# EAGLE design sproutstrip-6in (EAGLE 5.07)
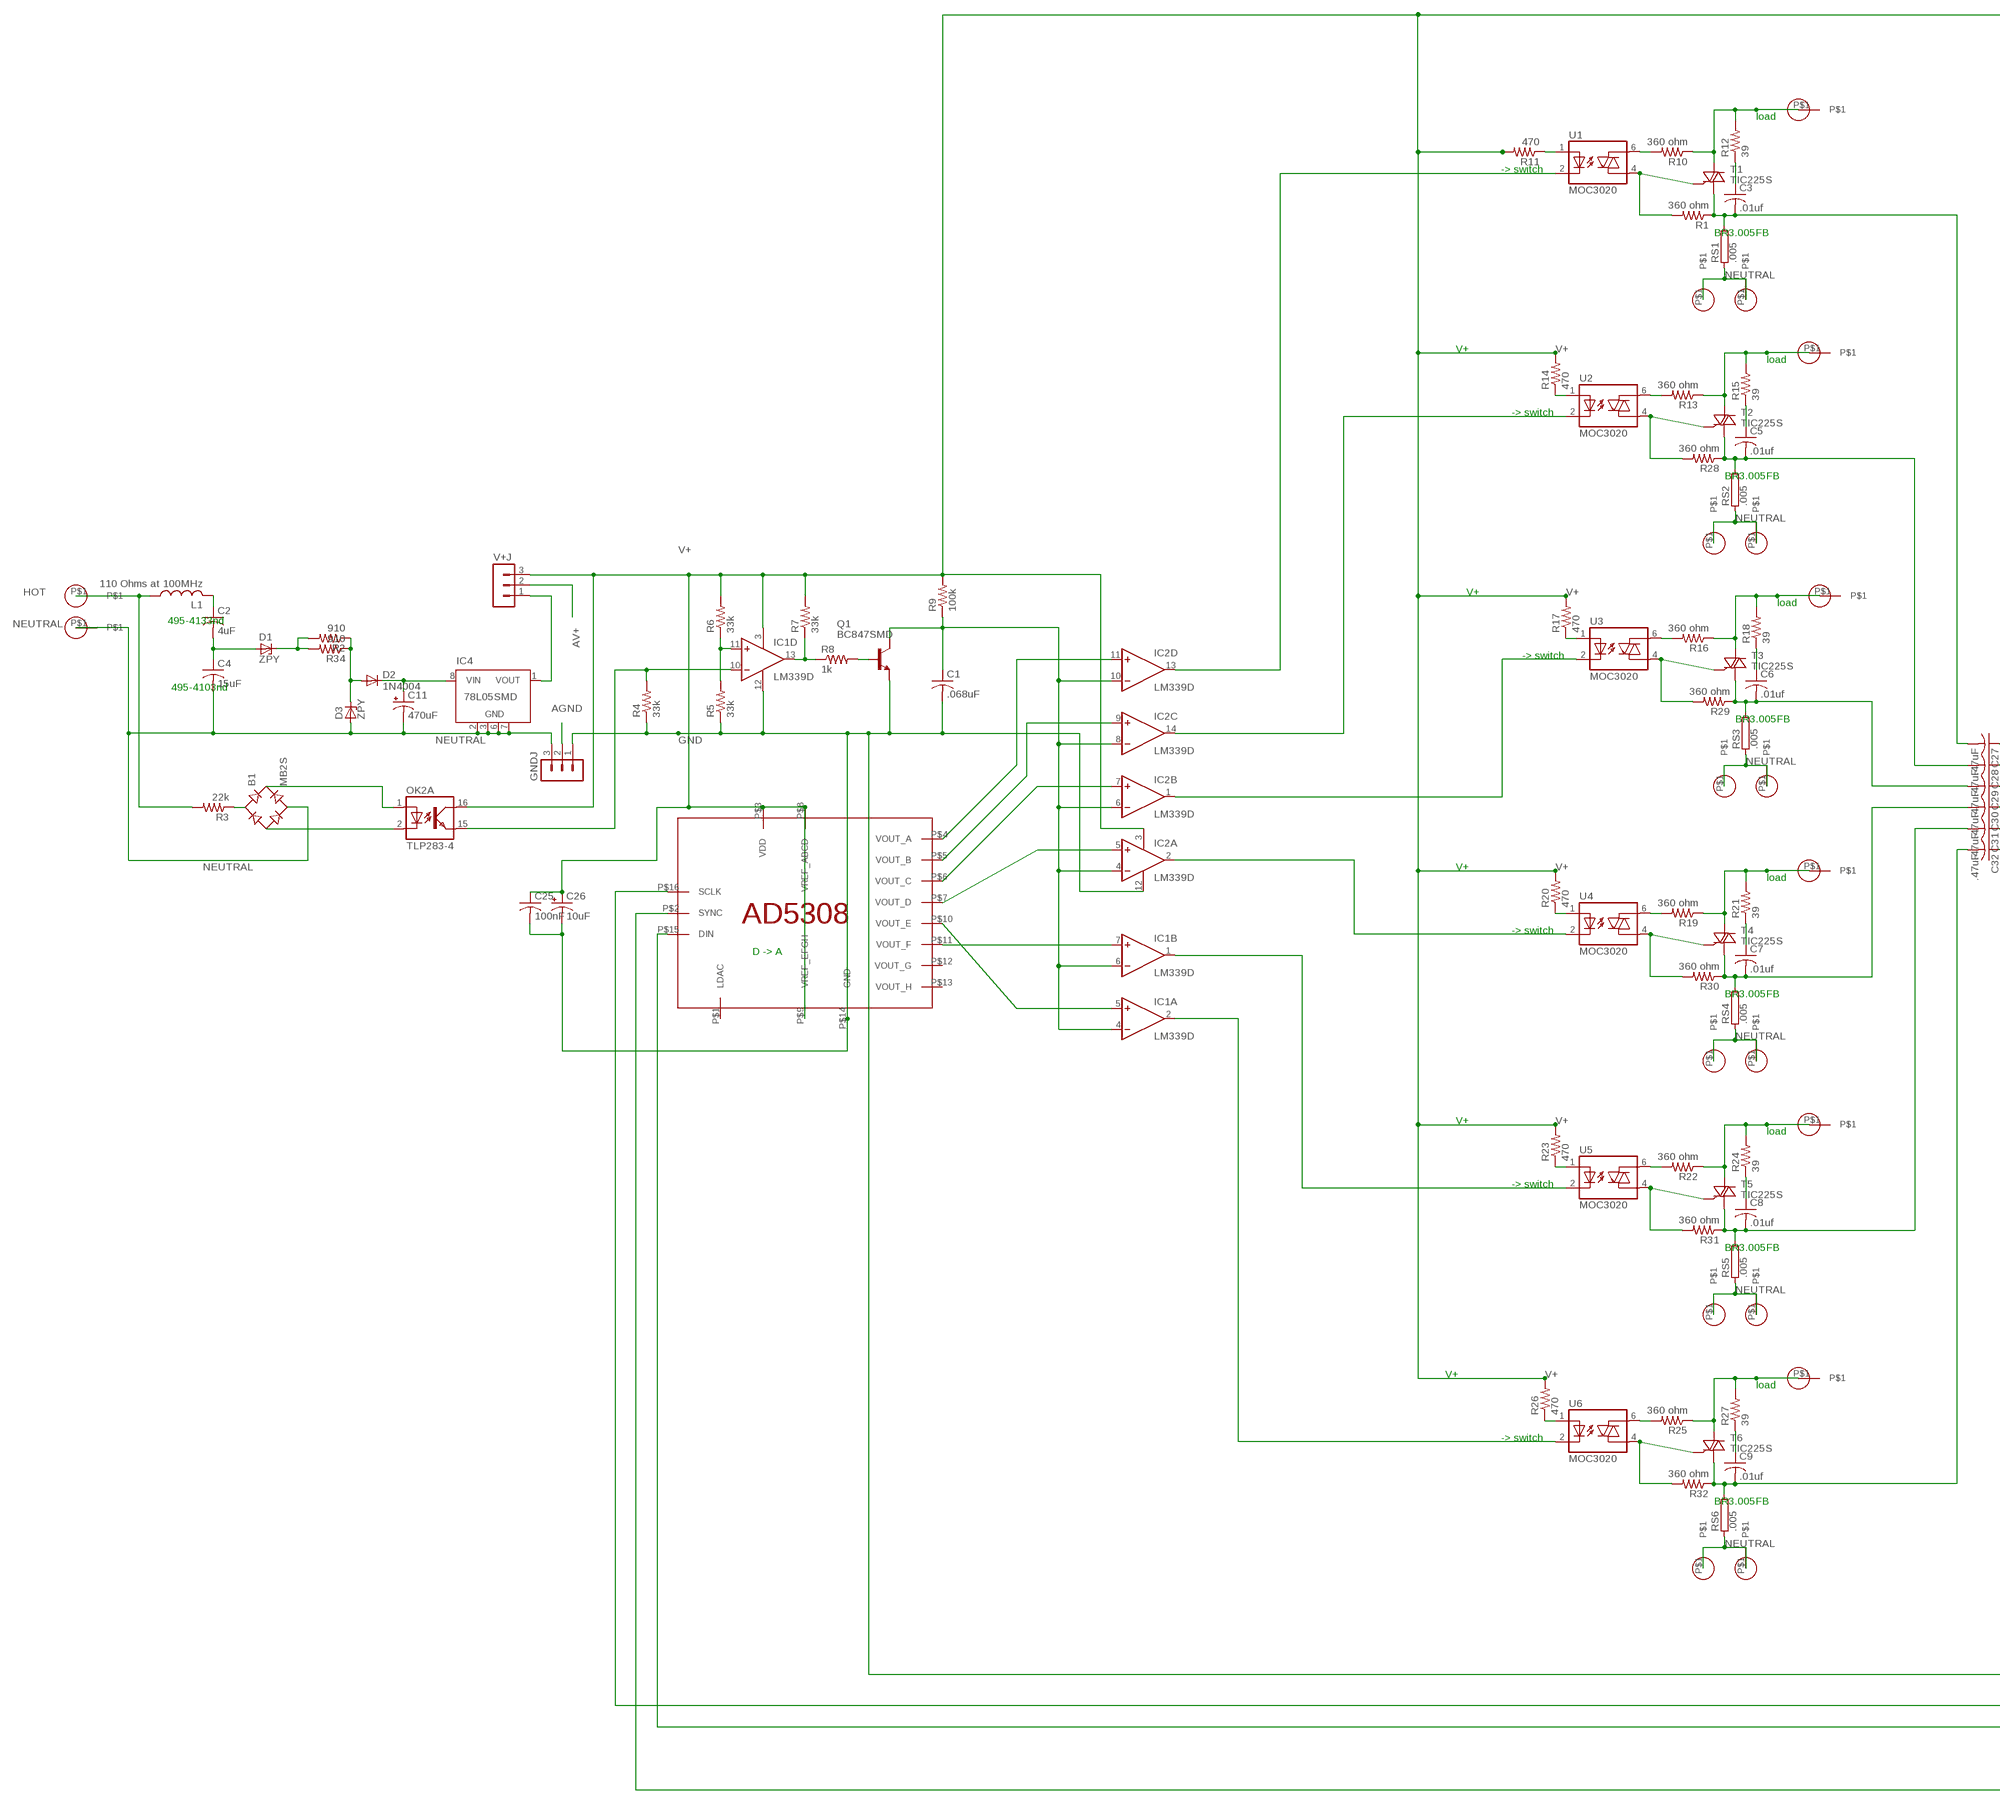
[diagram p0: schematic, sheet 1, part 1 of 2]
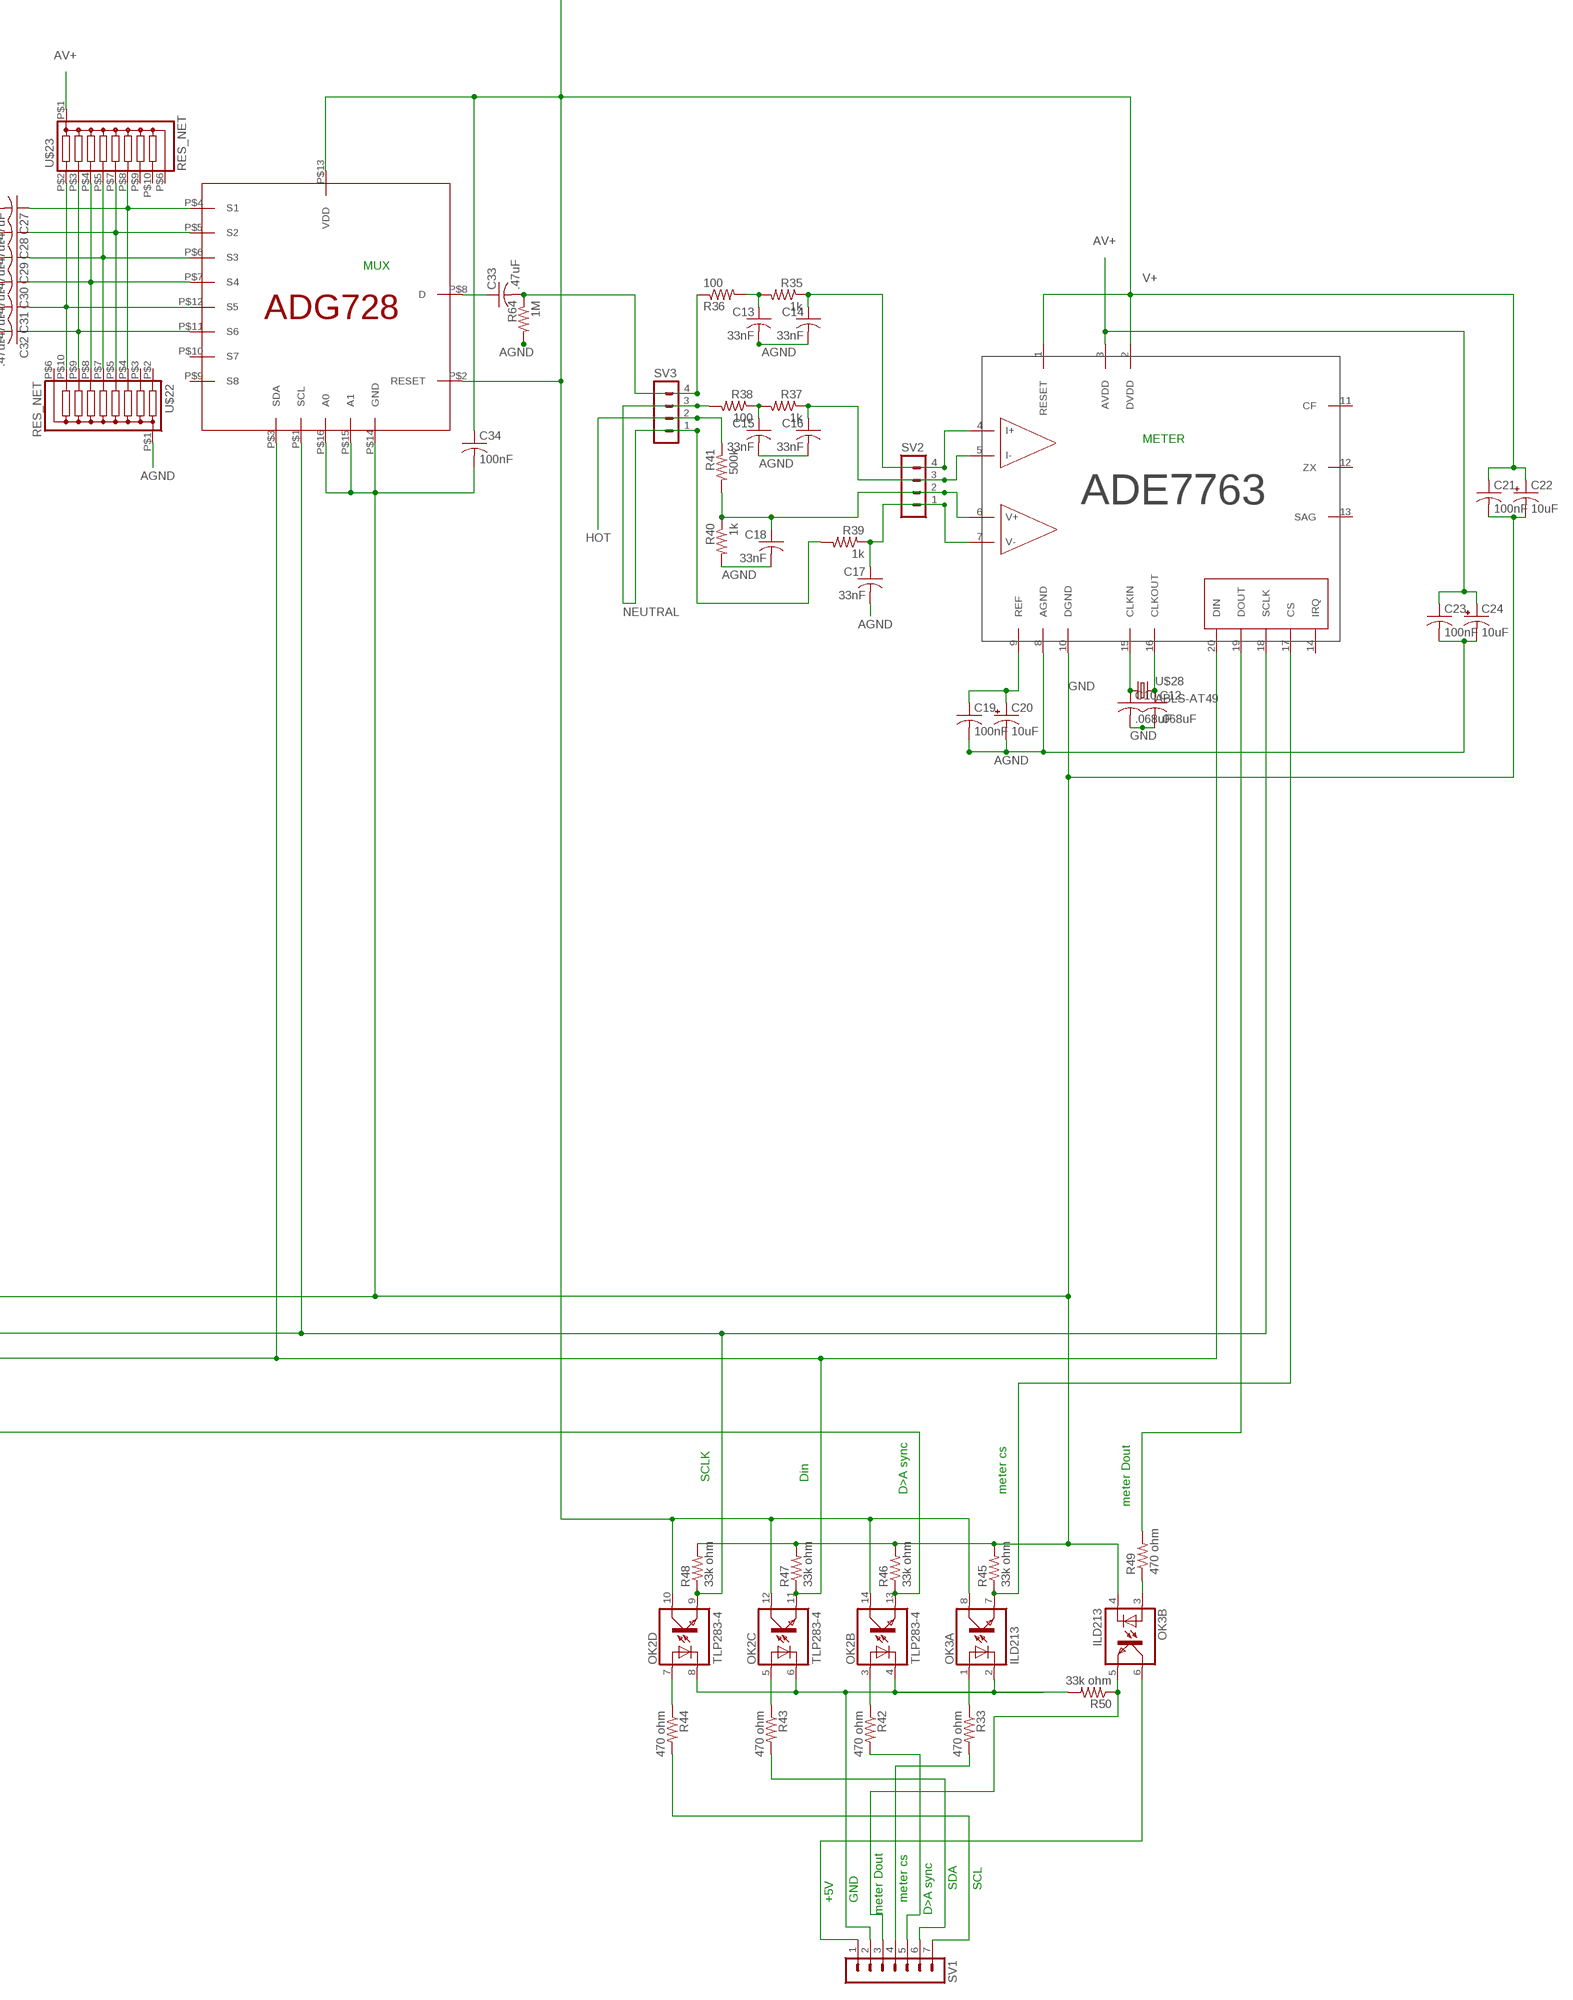
[diagram p1: schematic, sheet 1, part 2 of 2]

## Parts
B1  MB2S  [SOIC-4]
C1  .068uF  C-USC0805  [C0805]
C2  4uF  C-US275-113X316  [C275-113X316]
C3  .01uf  C-USC1206  [C1206]
C4  15uF  C-US275-113X316  [C275-113X316]
C5  .01uf  C-USC1206  [C1206]
C6  .01uf  C-USC1206  [C1206]
C7  .01uf  C-USC1206  [C1206]
C8  .01uf  C-USC1206  [C1206]
C9  .01uf  C-USC1206  [C1206]
C10  .068uF  C-USC0805  [C0805]
C11  470uF  CPOL-USTT5D10  [TT5D10]
C12  .068uF  C-USC0805  [C0805]
C13  33nF  C-USC0805  [C0805]
C14  33nF  C-USC0805  [C0805]
C15  33nF  C-USC0805  [C0805]
C16  33nF  C-USC0805  [C0805]
C17  33nF  C-USC0805  [C0805]
C18  33nF  C-USC0805  [C0805]
C19  100nF  C-USC0805  [C0805]
C20  10uF  CPOL-USA  [PANASONIC_A]
C21  100nF  C-USC0805  [C0805]
C22  10uF  CPOL-USA  [PANASONIC_A]
C23  100nF  C-USC0805  [C0805]
C24  10uF  CPOL-USA  [PANASONIC_A]
C25  100nF  C-USC0805  [C0805]
C26  10uF  CPOL-USA  [PANASONIC_A]
C27  .47uF  C-USC0805  [C0805]
C28  .47uF  C-USC0805  [C0805]
C29  .47uF  C-USC0805  [C0805]
C30  .47uF  C-USC0805  [C0805]
C31  .47uF  C-USC0805  [C0805]
C32  .47uF  C-USC0805  [C0805]
C33  .47uF  C-USC0805  [C0805]
C34  100nF  C-USC0805  [C0805]
D1  ZPY  [DO41Z10]
D2  1N4004  [DO41-10]
D3  ZPY  [DO41Z10]
GNDJ  MA03-1  [MA03-1]
IC1  LM339D  [SO14]
IC2  LM339D  [SO14]
IC4  78L05SMD  [SO08]
L1  110 Ohms at 100MHz  L-US0207/5V  [0207/5V]
OK2  TLP283-4  [MINI-FLAT-16]
OK3  ILD213  [SOIC08]
Q1  BC847SMD  [SOT23]
R1  360 ohm  R-US_R0805  [R0805]
R2  910  R-US_0309/V  [0309V]
R3  22k  R-US_R0805  [R0805]
R4  33k  R-US_R0805  [R0805]
R5  33k  R-US_R0805  [R0805]
R6  33k  R-US_R0805  [R0805]
R7  33k  R-US_R0805  [R0805]
R8  1k  R-US_R0805  [R0805]
R9  100k  R-US_R0805  [R0805]
R10  360 ohm  R-US_R0805  [R0805]
R11  470  R-US_R0805  [R0805]
R12  39  R-US_M1206  [M1206]
R13  360 ohm  R-US_R0805  [R0805]
R14  470  R-US_R0805  [R0805]
R15  39  R-US_M1206  [M1206]
R16  360 ohm  R-US_R0805  [R0805]
R17  470  R-US_R0805  [R0805]
R18  39  R-US_M1206  [M1206]
R19  360 ohm  R-US_R0805  [R0805]
R20  470  R-US_R0805  [R0805]
R21  39  R-US_M1206  [M1206]
R22  360 ohm  R-US_R0805  [R0805]
R23  470  R-US_R0805  [R0805]
R24  39  R-US_M1206  [M1206]
R25  360 ohm  R-US_R0805  [R0805]
R26  470  R-US_R0805  [R0805]
R27  39  R-US_M1206  [M1206]
R28  360 ohm  R-US_R0805  [R0805]
R29  360 ohm  R-US_R0805  [R0805]
R30  360 ohm  R-US_R0805  [R0805]
R31  360 ohm  R-US_R0805  [R0805]
R32  360 ohm  R-US_R0805  [R0805]
R33  470 ohm  R-US_R0805  [R0805]
R34  910  R-US_0309/V  [0309V]
R35  1k  R-US_R0805  [R0805]
R36  100  R-US_R0805  [R0805]
R37  1k  R-US_R0805  [R0805]
R38  100  R-US_R0805  [R0805]
R39  1k  R-US_R0805  [R0805]
R40  1k  R-US_R0805  [R0805]
R41  500k  R-US_R0805  [R0805]
R42  470 ohm  R-US_R0805  [R0805]
R43  470 ohm  R-US_R0805  [R0805]
R44  470 ohm  R-US_R0805  [R0805]
R45  33k ohm  R-US_R0805  [R0805]
R46  33k ohm  R-US_R0805  [R0805]
R47  33k ohm  R-US_R0805  [R0805]
R48  33k ohm  R-US_R0805  [R0805]
R49  470 ohm  R-US_R0805  [R0805]
R50  33k ohm  R-US_R0805  [R0805]
R64  1M  R-US_R0805  [R0805]
RS1  .005  RKP292  [KP292]
RS2  .005  RKP292  [KP292]
RS3  .005  RKP292  [KP292]
RS4  .005  RKP292  [KP292]
RS5  .005  RKP292  [KP292]
RS6  .005  RKP292  [KP292]
SV1  MA07-1  [MA07-1]
SV2  MA04-1  [MA04-1]
SV3  MA04-1  [MA04-1]
T1  TIC225S  [TO220DS]
T2  TIC225S  [TO220DS]
T3  TIC225S  [TO220DS]
T4  TIC225S  [TO220DS]
T5  TIC225S  [TO220DS]
T6  TIC225S  [TO220DS]
U1  MOC3020  [DIL06C]
U2  MOC3020  [DIL06C]
U3  MOC3020  [DIL06C]
U4  MOC3020  [DIL06C]
U5  MOC3020  [DIL06C]
U6  MOC3020  [DIL06C]
U$1  AD5308  [TSSOP16A]
U$2  WIRE_HOLE  [WIRE_HOLE]
U$3  WIRE_HOLE  [WIRE_HOLE]
U$4  WIRE_HOLE  [WIRE_HOLE]
U$5  WIRE_HOLE  [WIRE_HOLE]
U$6  WIRE_HOLE  [WIRE_HOLE]
U$7  WIRE_HOLE  [WIRE_HOLE]
U$8  WIRE_HOLE  [WIRE_HOLE]
U$9  WIRE_HOLE  [WIRE_HOLE]
U$10  WIRE_HOLE  [WIRE_HOLE]
U$11  WIRE_HOLE  [WIRE_HOLE]
U$12  WIRE_HOLE  [WIRE_HOLE]
U$13  WIRE_HOLE  [WIRE_HOLE]
U$14  WIRE_HOLE  [WIRE_HOLE]
U$15  WIRE_HOLE  [WIRE_HOLE]
U$16  WIRE_HOLE  [WIRE_HOLE]
U$17  WIRE_HOLE  [WIRE_HOLE]
U$18  WIRE_HOLE  [WIRE_HOLE]
U$19  WIRE_HOLE  [WIRE_HOLE]
U$20  WIRE_HOLE  [WIRE_HOLE]
U$21  WIRE_HOLE  [WIRE_HOLE]
U$22  RES_NET  [RES_NET]
U$23  RES_NET  [RES_NET]
U$26  ADE7763  [SSOP20DB]
U$27  ADG728  [TSSOP16B]
U$28  ABLS-AT49  [ABLS]
V+J  MA03-1  [MA03-1]

## Nets
AGND: C13.2 C14.2 C15.2 C16.2 C17.2 C18.2 C19.2 C20.- C23.2 C24.- GNDJ.2 R40.2 R64.2 U$22.P$1(C1) U$26.8(AGND)
AV+: C23.1 C24.+ U$23.P$1(C1) U$26.3(AVDD) V+J.2
EXT_+5V: OK3.6(B:COL) SV1.1
EXT_GND: OK2.4(B:C) OK2.6(C:C) OK2.8(D:C) OK3.2(A:C) R50.2 SV1.2
GND: C1.2 C10.2 C12.2 C21.2 C22.- C25.2 C26.- C34.2 GNDJ.1 IC1.12(P:GND) IC2.12(P:GND) OK3.4(B:C) Q1.2(E) R4.1 R5.1 R45.2 R46.2 R47.2 R48.2 U$1.P$14(GND) U$26.10(DGND) U$27.P$14(GND) U$27.P$15(A1) U$27.P$16(A0)
HOT: L1.1 R3.2 R41.1 SV3.2 U$21.P$1
I$1: IC2.13(D:OUT) U1.2(C)
I$2: IC2.14(C:OUT) U2.2(C)
I$3: IC2.1(B:OUT) U3.2(C)
I$4: IC2.2(A:OUT) U4.2(C)
I$6: IC1.2(A:OUT) U6.2(C)
L$1: R10.1 R12.2 T1.A2 U$2.P$1
L$2: R13.1 R15.2 T2.A2 U$5.P$1
L$3: R16.1 R18.2 T3.A2 U$8.P$1
L$4: R19.1 R21.2 T4.A2 U$11.P$1
L$5: R22.1 R24.2 T5.A2 U$14.P$1
L$6: R25.1 R27.2 T6.A2 U$17.P$1
N$2: D1.C R2.2 R34.2
N$3: IC1.10(D:-IN) OK2.15(A:EMIT) R4.2
N$5: R11.1 U1.1(A)
N$6: IC1.11(D:+IN) R5.2 R6.1
N$7: IC1.13(D:OUT) R7.1 R8.1
N$8: IC2.9(C:+IN) U$1.P$5(VOUT_B)
N$9: Q1.1(B) R8.2
N$10: IC2.7(B:+IN) U$1.P$6(VOUT_C)
N$11: IC2.5(A:+IN) U$1.P$7(VOUT_D)
N$12: IC1.5(A:+IN) U$1.P$10(VOUT_E)
N$13: IC2.11(D:+IN) U$1.P$4(VOUT_A)
N$14: IC1.7(B:+IN) U$1.P$11(VOUT_F)
N$15: R1.2 T1.G U1.4(A1)
N$16: R10.2 U1.6(A2)
N$17: C33.1 U$27.P$8(D)
N$18: R14.1 U2.1(A)
N$19: R16.2 U3.6(A2)
N$20: C5.1 R15.1
N$21: R13.2 U2.6(A2)
N$22: C31.1 U$22.P$10 U$23.P$2 U$27.P$12(S5)
N$23: R17.1 U3.1(A)
N$24: C6.2 C29.2 R29.1 RS3.2 T3.A1
N$25: C6.1 R18.1
N$26: C19.1 C20.+ U$26.9(REF)
N$27: C2.2 C4.1 D1.A
N$28: B1.~1(AC1) R3.1
N$29: B1.+ OK2.1(A:A)
N$30: B1.- OK2.2(A:C)
N$31: C2.1 L1.2
N$32: D2.A D3.C R2.1 R34.1
N$33: R20.1 U4.1(A)
N$34: C7.1 R21.1
N$35: C3.1 R12.1
N$36: R19.2 U4.6(A2)
N$37: OK3.1(A:A) R33.1
N$38: R23.1 U5.1(A)
N$39: C8.1 R24.1
N$40: R22.2 U5.6(A2)
N$41: R26.1 U6.1(A)
N$42: R28.2 T2.G U2.4(A1)
N$43: C9.1 R27.1
N$44: R25.2 U6.6(A2)
N$45: R29.2 T3.G U3.4(A1)
N$46: R30.2 T4.G U4.4(A1)
N$47: R31.2 T5.G U5.4(A1)
N$48: R32.2 T6.G U6.4(A1)
N$49: C32.1 U$22.P$9 U$23.P$3 U$27.P$11(S6)
N$50: OK2.3(B:A) R42.1
N$51: IC1.1(B:OUT) U5.2(C)
N$52: OK2.5(C:A) R43.1
N$53: OK2.7(D:A) R44.1
N$55: OK3.7(A:EMIT) R45.1 U$26.17(CS)
N$57: R44.2 SV1.7
N$58: C11.+ D2.C IC4.8(VIN)
N$59: R43.2 SV1.6
N$60: R42.2 SV1.5
N$63: OK3.3(B:A) R49.1
N$64: C9.2 C32.2 R32.1 RS6.2 T6.A1
N$66: OK3.5(B:EMIT) R50.1 SV1.3
N$67: C10.1 U$26.15(CLKIN) U$28.P$1
N$68: C12.1 U$26.16(CLKOUT) U$28.P$2
N$69: C16.1 R37.1 SV2.3 U$26.5(I-)
N$70: C18.1 R40.1 R41.2 SV2.2 U$26.6(V+)
N$71: R49.2 U$26.19(DOUT)
N$72: C17.1 R39.1 SV2.1 U$26.7(V-)
N$73: R33.2 SV1.4
N$74: C8.2 C31.2 R31.1 RS5.2 T5.A1
N$75: C13.1 R35.2 R36.2
N$76: OK2.13(B:EMIT) R46.1 U$1.P$2(SYNC)
N$78: C15.1 R37.2 R38.1
N$79: IC4.1(VOUT) V+J.1
N$80: C7.2 C30.2 R30.1 RS4.2 T4.A1
N$83: C30.1 U$22.P$8 U$23.P$4 U$27.P$7(S4)
N$84: C29.1 U$22.P$7 U$23.P$5 U$27.P$6(S3)
N$85: C28.1 U$22.P$5 U$23.P$7 U$27.P$5(S2)
N$86: C27.1 U$22.P$4 U$23.P$8 U$27.P$4(S1)
N$87: C5.2 C28.2 R28.1 RS2.2 T2.A1
N$88: C3.2 C27.2 R1.1 RS1.2 T1.A1
N$89: C33.2 R36.1 R64.1 SV3.4
NEUTRAL: B1.~2(AC2) C4.2 C11.- D3.A GNDJ.3 IC4.2(GND) IC4.3(GND) IC4.6(GND) IC4.7(GND) R38.2 R39.2 RS1.1 RS2.1 RS3.1 RS4.1 RS5.1 RS6.1 SV3.1 SV3.3 U$3.P$1 U$4.P$1 U$6.P$1 U$7.P$1 U$9.P$1 U$10.P$1 U$12.P$1 U$13.P$1 U$15.P$1 U$16.P$1 U$18.P$1 U$19.P$1 U$20.P$1
O$2: C14.1 R35.1 SV2.4 U$26.4(I+)
SAW: C1.1 IC1.4(A:-IN) IC1.6(B:-IN) IC2.4(A:-IN) IC2.6(B:-IN) IC2.8(C:-IN) IC2.10(D:-IN) Q1.3(C) R9.1
SCL: OK2.9(D:EMIT) R48.1 U$1.P$16(SCLK) U$26.18(SCLK) U$27.P$1(SCL)
SDA: OK2.11(C:EMIT) R47.1 U$1.P$15(DIN) U$26.20(DIN) U$27.P$3(SDA)
V+: C21.1 C22.+ C25.1 C26.+ C34.1 IC1.3(P:V+) IC2.3(P:V+) OK2.10(D:COL) OK2.12(C:COL) OK2.14(B:COL) OK2.16(A:COL) OK3.8(A:COL) R6.2 R7.2 R9.2 R11.2 R14.2 R17.2 R20.2 R23.2 R26.2 U$1.P$3(VDD) U$1.P$8(VREF_ABCD) U$1.P$9(VREF_EFGH) U$26.1(RESET) U$26.2(DVDD) U$27.P$2(RESET) U$27.P$13(VDD) V+J.3
Unconnected: IC1.8(C:-IN) IC1.9(C:+IN) IC1.14(C:OUT) IC4.4(NC) IC4.5(NC) U$1.P$1(LDAC) U$1.P$12(VOUT_G) U$1.P$13(VOUT_H) U$22.P$2 U$22.P$3 U$22.P$6(C2) U$23.P$6(C2) U$23.P$9 U$23.P$10 U$26.11(CF) U$26.12(ZX) U$26.13(SAG) U$26.14(IRQ) U$27.P$9(S8) U$27.P$10(S7)

## Notes on the sheet
- load
- -> switch
- BR3.005FB
- V+
- load
- -> switch
- BR3.005FB
- V+
- load
- 495-4133nd
- -> switch
- 495-4103nd
- BR3.005FB
- MUX
- V+
- load
- -> switch
- METER
- D -> A
- BR3.005FB
- V+
- load
- -> switch
- BR3.005FB
- V+
- load
- -> switch
- BR3.005FB
- SCLK | Din
- D>A sync | meter cs
- meter Dout
- SDA | SCL
- +5V | GND | meter cs
- meter Dout | D>A sync

## Library data of the parts
B1 = rectifier:MB*S: Bridge Rectifier Source: http://www.fairchildsemi.com/ds/MB/MB6S.pdf
C1-C10 C12-C19 C21 C23 C25 C27-C34 = rcl:C-US: CAPACITOR, American symbol
C11 C20 C22 C24 C26 = rcl:CPOL-US: POLARIZED CAPACITOR, American symbol
D1 D3 = diode:ZPY: Z DIODE 1 W
D2 = diode:1N4004: DIODE general purpose rectifier, 1 A
GNDJ V+J = con-lstb:MA03-1: PIN HEADER
IC1 IC2 = linear:LM339: Low Power Low Offset Voltage Quad Comparators with open collector; LM139/LM239/LM339/LM2901/LM3302
IC4 = linear:78L*SMD: Positive VOLTAGE REGULATOR
L1 = rcl:L-US: INDUCTOR, American symbol
OK2 = optocoupler-2:TLP283-4: TOSHIBA PHOTOCOUPLER GaAs IRED & PHOTO-TRANSISTOR Source: http://www.semicon.toshiba.co.jp/td/en/Opto/Photocoupler/en_20050928_TLP283_datasheet.pdf
OK3 = optocoupler:ILD2*: Siemens ILD205/206/207/211/213/217 DUAL PHOTOTRANSISTOR SMALL OUTLINE SURFACE MOUNT OPTOCOUPLER Source: 153385-da-01-en-Optocoupler_ILD205-T.pdf
Q1 = transistor-npn:BC847*: NPN Transistor
R1-R50 R64 = rcl:R-US_: RESISTOR, American symbol
RS1-RS6 = resistor-power:R: Power Resitor
SV1 = con-lstb:MA07-1: PIN HEADER
SV2 SV3 = con-lstb:MA04-1: PIN HEADER
T1-T6 = triac:TIC225S: TRIAC
U1-U6 = optocoupler:MOC3020
U$1 = strip:AD5308
U$2-U$21 = strip:WIRE_HOLE
U$22 U$23 = strip:RES_NET
U$26 = strip:ADE7763
U$27 = strip:ADG728
U$28 = crystal:ABLS-AT49

## Board
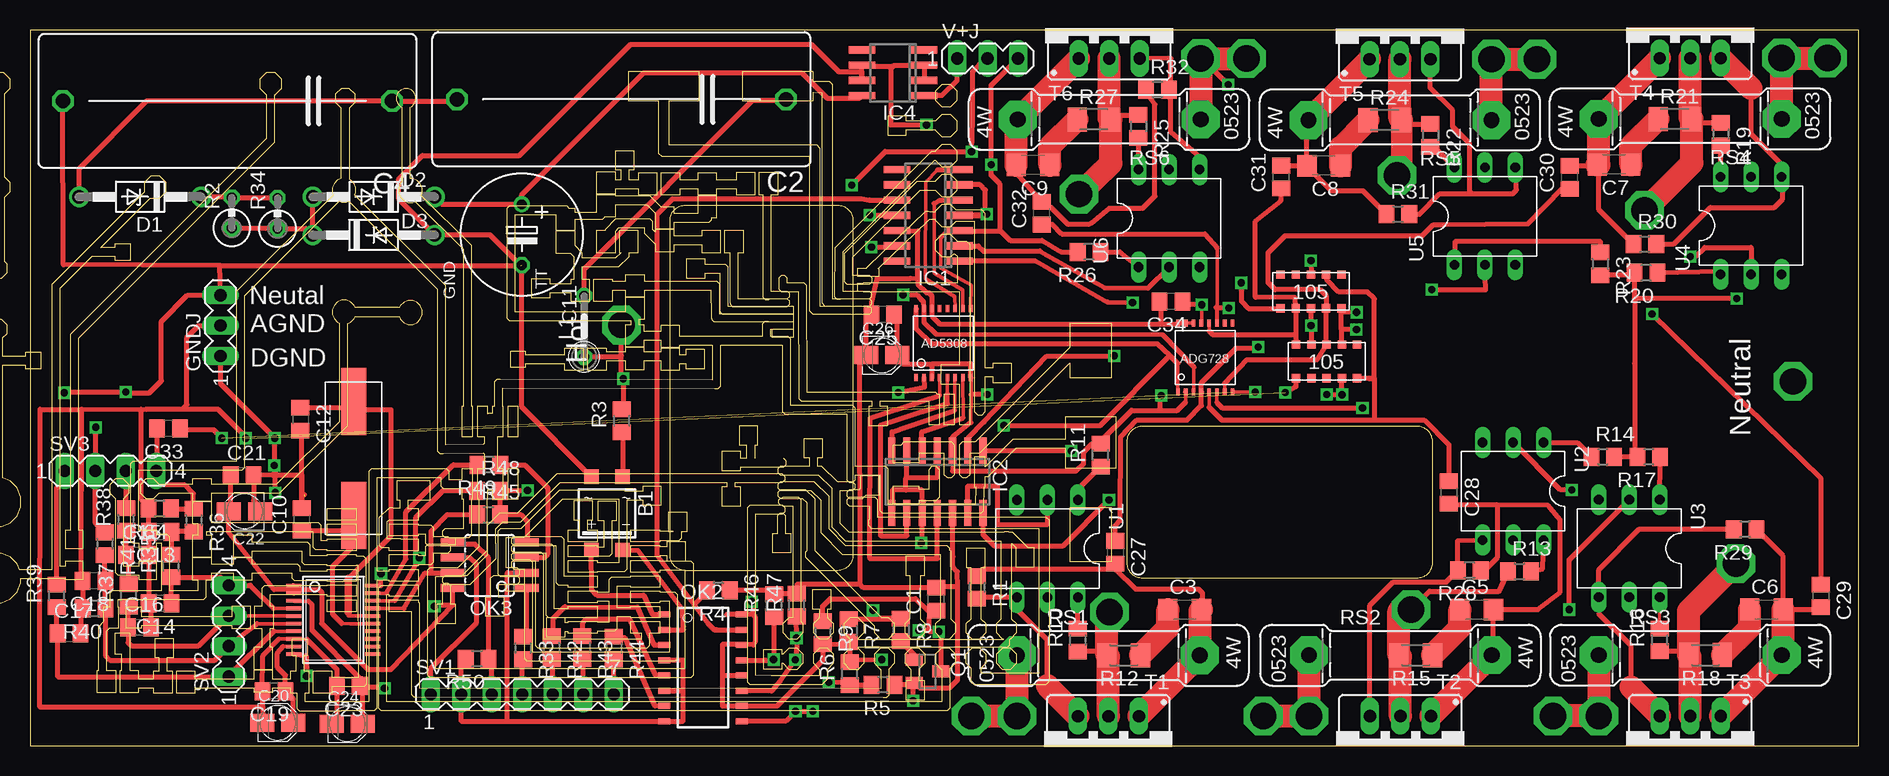
[diagram p2: board, top side]
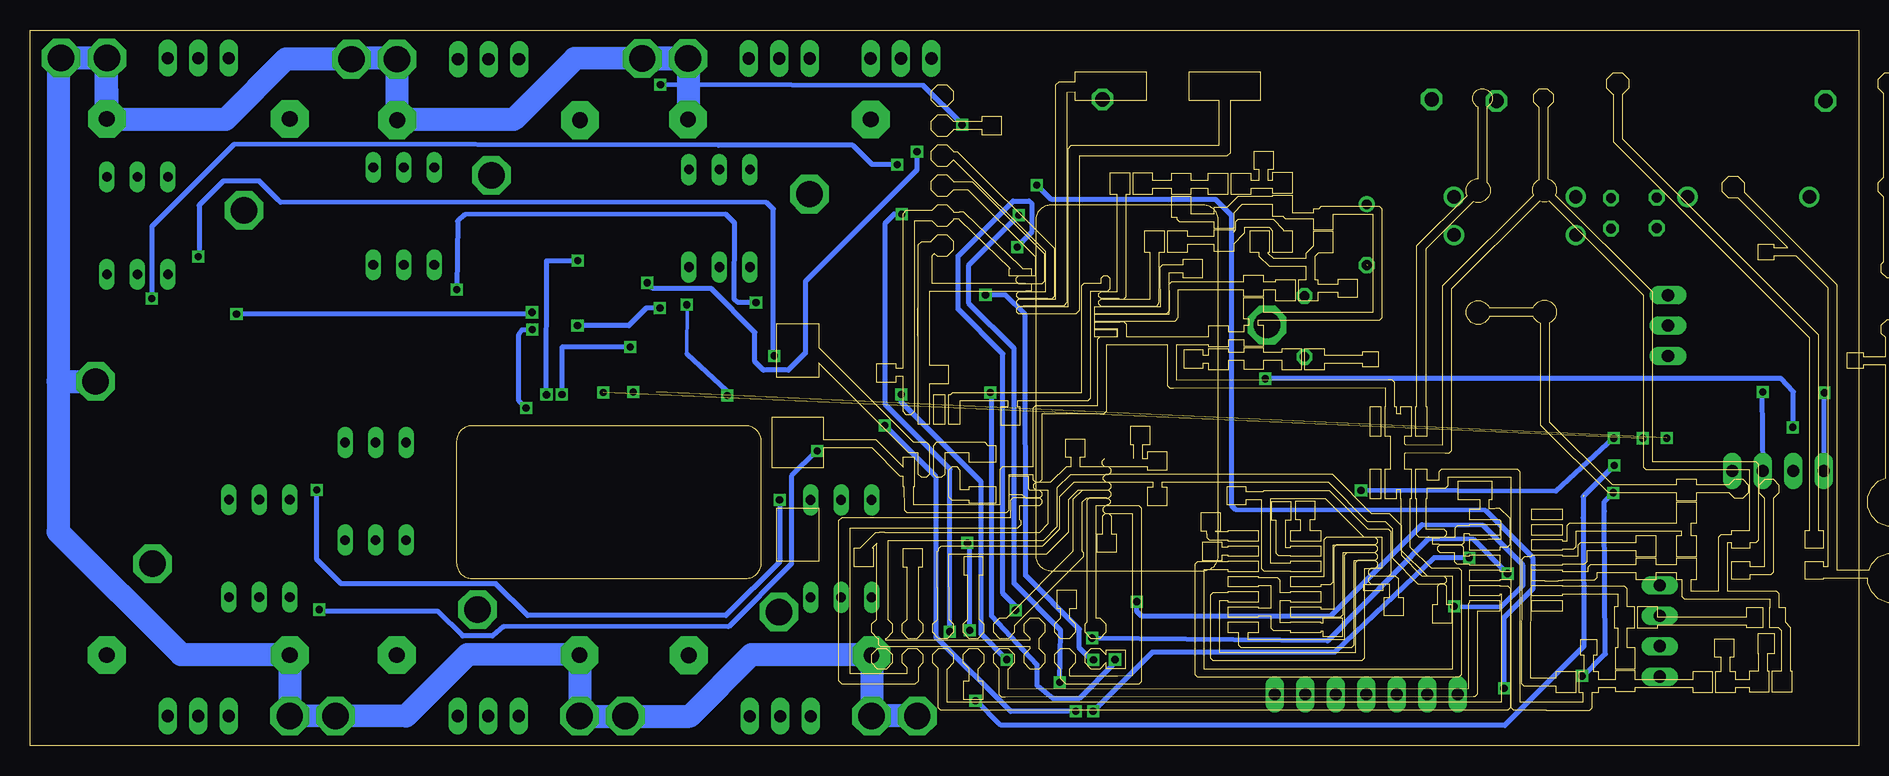
[diagram p3: board, bottom side, seen from below]

Size 152.38 x 59.69 mm. Coordinates in mm from the lower left corner, seen from the top.
Outline: 0,0 152.38,0 152.38,59.69 0,59.69 0,0
Outline: 115.57,26.67 arc-90 116.84,25.4 116.84,15.24 arc-90 115.57,13.97 92.71,13.97 arc-90 91.44,15.24 91.44,25.4 arc-90 92.71,26.67 115.57,26.67
Outline: 67.31,45.09 arc-90 68.58,43.81 68.58,15.88 arc-90 67.31,14.61 54.61,14.61 arc-90 53.34,15.88 53.34,43.81 arc-90 54.61,45.09 67.31,45.09
Copper layers (1*16): Top 0.035mm / dielectric 1.5mm / Bottom 0.035mm
Design rules "default *": minimum track width 10mil, minimum drill 24mil, track to track 0.21mm, track to pad 0.21mm, pad to pad 0.21mm, via to via 0.21mm, smd to smd 0.21mm, copper to edge 40mil, drill to drill 8mil, minimum pad ring 10mil, minimum via ring 8mil, stop-mask expansion 4mil, vias tented up to drill 0mil, thermal gap 10mil
Milling: 2023 lines

### Footprints (pad centres in the part's own frame; a part is rotated, then mirrored left to right if it is on the bottom)
SOIC-4 = smd 1.2 x 1.2: + 1.3,3.05; - -1.3,3.05; ~1 -1.3,-3.05; ~2 1.3,-3.05
C0805 = smd 1.3 x 1.5: 1 -0.95,0; 2 0.95,0
C275-113X316 = drill 1.194 octagon: 1 -13.716,0; 2 13.716,0
C1206 = smd 1.6 x 1.8: 1 -1.4,0; 2 1.4,0
TT5D10 = drill 0.813 round: + -2.54,0 | drill 0.813 octagon: - 2.54,0
PANASONIC_A = smd 2 x 1.5: + 1.3,0; - -1.3,0
DO41Z10 = drill 1.118 round: A 5.08,0; C -5.08,0
DO41-10 = drill 1.118 round: A 5.08,0; C -5.08,0
MA03-1 = drill 1.016 long: 1 -2.54,0; 2 0,0; 3 2.54,0
SO14 = smd 0.6 x 2.2: 1 -3.81,-2.6; 2 -2.54,-2.6; 3 -1.27,-2.6; 4 0,-2.6; 5 1.27,-2.6; 6 2.54,-2.6; 7 3.81,-2.6; 8 3.81,2.6; 9 2.54,2.6; 10 1.27,2.6; 11 0,2.6; 12 -1.27,2.6; 13 -2.54,2.6; 14 -3.81,2.6
SO08 = smd 0.6 x 2.2: 1 -1.905,-2.6; 2 -0.635,-2.6; 3 0.635,-2.6; 4 1.905,-2.6; 5 1.905,2.6; 6 0.635,2.6; 7 -0.635,2.6; 8 -1.905,2.6
0207/5V = drill 0.813 octagon: 1 -2.54,0; 2 2.54,0
MINI-FLAT-16 = smd 1 x 0.5: 1 -3.24,4.445; 2 -3.24,3.175; 3 -3.24,1.905; 4 -3.24,0.635; 5 -3.24,-0.635; 6 -3.24,-1.905; 7 -3.24,-3.175; 8 -3.24,-4.445; 9 3.24,-4.445; 10 3.24,-3.175; 11 3.24,-1.905; 12 3.24,-0.635; 13 3.24,0.635; 14 3.24,1.905; 15 3.24,3.175; 16 3.24,4.445
SOIC08 = smd 0.66 x 2.032: 1 -1.905,-3.073; 2 -0.635,-3.073; 3 0.635,-3.073; 4 1.905,-3.073; 5 1.905,3.073; 6 0.635,3.073; 7 -0.635,3.073; 8 -1.905,3.073
SOT23 = smd 1 x 1.4: 1 -0.95,-1.1; 2 0.95,-1.1; 3 0,1.1
R0805 = smd 1.3 x 1.5: 1 -0.95,0; 2 0.95,0
0309V = drill 0.813 octagon: 1 -1.27,0; 2 1.27,0
M1206 = smd 1.6 x 2: 1 -1.4,0; 2 1.4,0
KP292 = drill 1.321 pad 3.15 octagon: 1 -7.62,0; 2 7.62,0
MA07-1 = drill 1.016 long: 1 -7.62,0; 2 -5.08,0; 3 -2.54,0; 4 0,0; 5 2.54,0; 6 5.08,0; 7 7.62,0
MA04-1 = drill 1.016 long: 1 -3.81,0; 2 -1.27,0; 3 1.27,0; 4 3.81,0
TO220DS = drill 1.016 long: A1 -2.54,-2.54; A2 0,-2.54; G 2.54,-2.54
DIL06C = drill 0.8 long: 1 -2.54,-4.064; 2 0,-4.064; 3 2.54,-4.064; 4 2.54,4.064; 5 0,4.064; 6 -2.54,4.064
TSSOP16A = smd 0.305 x 0.61: P$1 -2.479,-2.872; P$2 -1.829,-2.872; P$3 -1.179,-2.872; P$4 -0.529,-2.872; P$5 0.121,-2.872; P$6 0.771,-2.872; P$7 1.421,-2.872; P$8 2.071,-2.872; P$9 2.071,2.878; P$10 1.421,2.878; P$11 0.771,2.878; P$12 0.121,2.878; P$13 -0.529,2.878; P$14 -1.179,2.878; P$15 -1.829,2.878; P$16 -2.479,2.878
WIRE_HOLE = drill 2.2 octagon: P$1 0,0
RES_NET = smd 0.7 x 0.7: P$1 -1.4,2.54; P$2 -1.4,1.27; P$3 -1.4,0; P$4 -1.4,-1.27; P$5 -1.4,-2.54; P$6 1.4,-2.54; P$7 1.4,-1.27; P$8 1.4,0; P$9 1.4,1.27; P$10 1.4,2.54
SSOP20DB = smd 0.305 x 1.245: 1 -2.857,-3.302; 2 -2.222,-3.302; 3 -1.587,-3.302; 4 -0.952,-3.302; 5 -0.317,-3.302; 6 0.318,-3.302; 7 0.953,-3.302; 8 1.588,-3.302; 9 2.223,-3.302; 10 2.858,-3.302; 11 2.858,3.302; 12 2.223,3.302; 13 1.588,3.302; 14 0.953,3.302; 15 0.318,3.302; 16 -0.317,3.302; 17 -0.952,3.302; 18 -1.587,3.302; 19 -2.222,3.302; 20 -2.857,3.302
TSSOP16B = smd 0.305 x 0.61: P$1 -2.483,-2.759; P$2 -1.833,-2.759; P$3 -1.183,-2.759; P$4 -0.533,-2.759; P$5 0.117,-2.759; P$6 0.767,-2.759; P$7 1.417,-2.759; P$8 2.067,-2.759; P$9 2.067,2.991; P$10 1.417,2.991; P$11 0.767,2.991; P$12 0.117,2.991; P$13 -0.533,2.991; P$14 -1.183,2.991; P$15 -1.833,2.991; P$16 -2.483,2.991
ABLS = smd 5.6 x 2.1: P$1 -4.75,0; P$2 4.75,0

### Placement (x,y rotation side)
B1  48.09,19.39 180 top
C1  75.52,12.23 90 top
C2  49.29,53.9 180 top
C3  96.22,11.36 0 top
C4  16.46,53.77 180 top
C5  120.55,11.37 0 top
C6  144.7,11.38 0 top
C7  132,48.46 180 top
C8  107.82,48.37 180 top
C9  83.58,48.42 180 top
C10  22.66,18.88 90 top
C11  40.99,42.62 270 top
C12  22.54,27.24 270 top
C13  10.85,17.84 180 top
C14  10.85,11.87 180 top
C15  8.95,15.91 0 top
C16  9.13,9.9 0 top
C17  3.26,9.37 0 top
C18  5.33,13.75 180 top
C19  20.33,4.56 180 top
C20  20.64,1.93 0 top
C21  17.68,22.54 0 top
C22  17.88,19.54 180 top
C23  26.53,4.98 180 top
C24  26.44,1.83 0 top
C25  71.06,35.95 180 top
C26  70.99,32.57 0 top
C27  90.43,16.13 270 top
C28  118.24,21.13 270 top
C29  149.23,12.5 270 top
C30  128.3,47.4 90 top
C31  104.26,47.43 90 top
C32  84.31,44.41 90 top
C33  11.54,26.45 180 top
C34  95.09,37.05 180 top
D1  9.18,45.78 180 top
D2  28.65,45.77 180 top
D3  28.64,42.59 0 top
GNDJ  15.88,35.03 90 top
IC1  74.86,44.23 90 top
IC2  75.61,22.02 180 top
IC4  71.92,56.11 90 top
L1  46.18,34.97 90 top
OK2  56.08,6.51 0 top
OK3  38.31,15.06 90 top
Q1  74.79,6.21 270 top
R1  78.91,13.21 270 top
R2  16.82,44.44 90 top
R3  49.31,27.11 90 top
R4  57.36,12.95 180 top
R5  71.09,5.08 180 top
R6  68.32,6.03 90 top
R7  68.25,9.62 270 top
R8  72.58,9.67 270 top
R9  66.06,9.44 270 top
R10  87.33,8.82 90 top
R11  89.22,24.23 90 top
R12  91.14,7.55 180 top
R13  124.12,14.55 0 top
R14  131.06,24.1 0 top
R15  115.47,7.56 180 top
R16  135.81,8.84 90 top
R17  134.89,24.08 180 top
R18  139.62,7.57 180 top
R19  140.89,51 270 top
R20  134.66,39.45 180 top
R21  137.08,52.27 0 top
R22  116.71,50.91 270 top
R23  130.85,40.2 270 top
R24  112.9,52.18 0 top
R25  92.37,51.65 270 top
R26  88.26,41.19 180 top
R27  88.66,52.23 0 top
R28  119.95,14.64 180 top
R29  142.93,18.04 180 top
R30  134.57,41.84 0 top
R31  113.99,44.33 0 top
R32  93.96,54.72 0 top
R33  41.09,8.16 270 top
R34  20.63,44.4 90 top
R35  11.76,15 90 top
R36  13.64,18.82 270 top
R37  8.23,12.54 90 top
R38  8.01,18.88 90 top
R39  2.22,12.5 90 top
R40  5.35,11.44 180 top
R41  6.23,16.85 270 top
R42  43.46,8.18 270 top
R43  46.02,8.2 270 top
R44  48.65,8.16 270 top
R45  38.22,19.28 0 top
R46  62.01,11.7 90 top
R47  63.9,11.74 90 top
R48  38.2,21.26 0 top
R49  38.24,23.44 180 top
R50  37.26,7.24 180 top
R64  10.81,19.78 180 top
RS1  89.87,7.55 0 top
RS2  114.2,7.56 0 top
RS3  138.35,7.57 0 top
RS4  138.35,52.27 180 top
RS5  114.17,52.18 180 top
RS6  89.93,52.23 180 top
SV1  41.02,4.3 0 top
SV2  16.56,9.58 90 top
SV3  6.7,22.92 0 top
T1  89.87,-0.07 180 top
T2  114.2,-0.06 180 top
T3  138.35,-0.05 180 top
T4  138.35,59.89 0 top
T5  114.17,59.8 0 top
T6  89.93,59.85 0 top
U1  84.79,16.44 180 top
U2  123.59,21.23 180 top
U3  133.27,16.46 180 top
U4  143.43,43.38 0 top
U5  121.23,44.16 0 top
U6  94.93,43.99 0 top
U$1  76.33,33.58 0 top
U$2  89.97,11.15 270 top
U$3  82.25,2.47 270 top
U$4  78.44,2.47 270 top
U$5  115.07,11.36 270 top
U$6  106.58,2.48 270 top
U$7  102.77,2.48 270 top
U$8  142.16,15.19 270 top
U$9  130.73,2.49 270 top
U$10  126.92,2.49 270 top
U$11  134.54,44.65 90 top
U$12  145.97,57.35 90 top
U$13  149.78,57.35 90 top
U$14  113.93,47.57 90 top
U$15  121.79,57.26 90 top
U$16  125.6,57.26 90 top
U$17  87.43,46 90 top
U$18  97.55,57.31 90 top
U$19  101.36,57.31 90 top
U$20  146.91,30.38 0 top
U$21  49.29,35.09 0 top
U$22  108.06,32.06 90 top
U$23  106.75,37.89 90 top
U$26  25.28,10.51 270 top
U$27  98.14,32.27 0 top
U$28  26.97,23.97 90 top
V+J  79.8,57.32 0 top

### Tracks (layer width: path | path; a pad name or v marks a point on that pad's centre or on a via)
AGND  (via drill 0.6)  (1 unrouted)
  Top 0.305: 20.75,8.92 U$26.8 22.01,8.89 23.08,8.89
  Top 0.406: C16.2 10.08,11.69 C14.2 C15.2 | C15.2 | C15.2 C13.2 9.86,17.88 R64.2 9.24,20.58 9.24,28.08 | C17.2 4.21,11.26 R40.2 4.4,13.72 C18.2 4.59,13.96 4.21,14.34 4.28,28.06 | 20.75,8.92 19.42,7.49 19.35,4.6 C19.2 19.38,3.28 | 19.38,3.28 19.38,1.98 C20.- | 23.08,8.89 25.58,6.39 C23.2 25.58,2.27 C24.- | 19.38,3.28 19.29,3.37 19.29,3.25 0.82,3.25 0.85,28.06 4.28,28.06 | 12.71,28.07 9.83,28.07 9.68,28.08 9.68,28.06 9.24,28.08 | 12.71,28.07 15.65,28.07 17.97,25.75 v17.97,25.65 | 4.28,28.06 9.24,28.08 | U$22.P$1 105.52,29.95 v104.61,29.47 | GNDJ.2 14.05,35.03 13.06,34.05 13.06,28.43 12.71,28.07
AV+  (via drill 0.6)
  Top 0.305: 23.2,12.06 22.01,12.06 U$26.3
  Top 0.406: C24.+ 27.74,4.72 C23.1 27.48,5.62 | 27.48,5.62 23.52,9.62 23.52,11.79 23.2,12.06 | U$23.P$1 104.19,36.48 101.53,36.48 100.94,37.07 v100.94,38.6 | V+J.2 79.66,57.32 78.56,56.22 78.56,52.26 v78.46,49.54 71.26,49.54 v68.47,46.76 | 27.48,5.62 27.67,5.62 27.67,4.9 29.54,4.9 v29.54,4.8
  Bottom 0.406: v100.94,38.6 100.47,38.13 95.63,38.13 91.96,34.47 91.96,32.04 91.25,31.33 89.19,31.33 87.77,32.75 87.77,38.72 78.46,48.02 v78.46,49.54 | v29.54,4.8 29.54,10.69 27.12,13.11 27.12,15.66 31.08,19.62 51.9,19.69 52.22,20.01 52.22,44.2 53.57,45.55 67.26,45.55 v68.47,46.76
EXT_+5V
  Top 0.406: SV1.1 33.4,6.45 37.21,10.26 37.21,15.12 36.66,15.66 35.27,15.66 OK3.6
EXT_GND
  Top 0.406: OK2.4 54.42,7.14 54.42,4.6 | OK2.6 54.42,4.6 | OK2.6 | 54.42,4.6 OK2.6 | 54.42,4.6 54.42,2.06 OK2.8 | 52.67,2.02 OK2.8 | R50.2 35.94,6.87 SV1.2 35.94,2.06 39.79,2.06 | 39.79,2.06 OK2.8 | OK3.2 39.79,14.43 39.79,2.06
GND  (via drill 0.6)  (1 unrouted)
  Top 0.305: U$27.P$15 U$27.P$14
  Top 0.406: U$27.P$15 U$27.P$16 95.59,35.18 94.25,35.18 | 69.18,13.45 69.14,32.02 C26.- 69.69,35.53 C25.2 70.13,35.98 70.13,36.95 70.59,38.97 73.38,38.97 73.99,38.99 | 69.18,13.45 69.45,13.18 C1.2 75.58,13.24 77.3,13.24 | 77.3,13.24 77.28,14.51 76.91,14.94 76.91,15.77 76.88,15.79 IC2.12 | 77.3,13.24 77.3,5.49 76.76,4.95 76.7,4.86 74.11,4.86 73.71,5.26 Q1.2 | 73.99,38.99 73.99,38.5 74.71,37.78 74.91,37.78 75.14,37.55 U$1.P$14 75.15,35.85 75.82,35.18 94.25,35.18 | IC1.12 73.92,42.88 73.99,42.93 73.99,38.99 | C34.2 94.25,36.93 94.25,35.18 | 69.18,13.45 63.9,13.45 R47.2 63.9,12.65 R46.2 | U$26.10 23,7.51 v23.05,5.82 | OK3.4 41.45,17.04 41.45,18.72 40.89,19.28 R45.2 39.15,19.29 R48.2 41.44,21.26 v41.46,21.28 | R46.2 61.75,12.91 | R4.1 61.72,12.95 R46.2 | R5.1 73.52,5.08 Q1.2 | v73.59,3.74 73.59,5.16 Q1.2 | 22.87,20.92 22.88,20.93 | C12.2 22.66,26.16 C10.2 22.66,22.58 20.23,22.58 | 19.98,19.54 C22.- 18.93,19.8 18.93,20.13 18.63,20.43 C21.2 20.23,22.58 | v20.44,21.1 20.44,22.79 | 20.44,22.79 20.44,23.31 v20.36,23.39 20.4,23.43 v20.4,25.65 15.88,30.17 GNDJ.1 | 20.44,22.79 20.23,22.58
  Bottom 0.406: v20.44,21.1 21.18,20.36 21.18,19.56 21.09,7.67 23.04,5.72 v23.05,5.82 | v41.46,21.28 25.23,21.21 v20.4,25.65 | v73.59,3.74 73.49,3.74 71.47,1.72 29.48,1.7 22.88,8.3 22.95,19.03 22.95,20.78 v20.36,23.39
HOT  (via drill 0.6)
  Top 0.406: R41.1 5.45,18.57 SV3.2 5.48,23.76 v5.48,26.56 | R3.2 49.44,28.19 v49.44,30.61 49.29,30.76 49.29,32.53 | 49.29,32.53 U$21.P$1 | L1.1 49.19,32.43 49.29,32.53
  Bottom 0.406: v49.44,30.61 6.42,30.62 5.42,29.54 5.42,26.46 5.4,26.46 v5.48,26.56
I$1
  Top 0.406: IC2.13 78.15,21.66 80.62,21.66 80.62,18.47 84.8,18.47 U1.2
I$2  (via drill 0.6)
  Top 0.406: IC2.14 79.42,17.6 80.35,16.68 86.08,16.68 v89.92,20.51 | U2.2 | U2.2 127.54,21.34 v128.48,21.34
  Bottom 0.406: v89.92,20.51 89.92,15.32 94.38,10.86 110.92,10.86 113.56,13.5 126.45,13.5 128.48,15.53 v128.48,21.34
I$3  (via drill 0.6)
  Top 0.406: v128.26,11.36 128.26,15.51 U3.2 | IC2.1 86.79,24.62 v86.79,24.58
  Bottom 0.406: v86.79,24.58 86.87,24.56 88.92,22.5 88.92,15.18 94.17,9.94 112.88,9.96 113.83,9.16 116.32,9.16 118.4,11.21 128.12,11.21 v128.26,11.36
I$4  (via drill 0.6)
  Top 0.406: U4.2 143.43,41.56 139.55,41.56 138.79,40.8 v138.36,40.8 | v90.35,32.52 84.73,32.5 79.49,27 78.22,25.72 78.22,24.69 IC2.2
  Bottom 0.406: v138.36,40.8 138.28,40.88 138.33,40.93 138.29,40.98 138.29,45.07 136.27,47.09 133.26,47.09 131.67,45.5 131.5,45.32 90.97,45.29 90.44,44.75 90.44,32.73 v90.35,32.52
I$6
  Top 0.406: IC1.2 79.03,41.69 79.47,41.24 84.16,41.26 89.54,38.19 93.16,38.16 U6.2
L$1
  Top 0.406: R10.1 89.42,7.87 R12.2
  Top 1.93: T1.A2 89.87,7.42 R12.2 89.74,11.23 U$2.P$1
L$2
  Top 0.406: R15.2 113.75,7.88 | U$5.P$1 116.61,12.9 122.41,12.9 122.47,12.96 R13.1
  Top 1.93: T2.A2 114.2,7.43 R15.2 114.07,11.24 U$5.P$1
L$3
  Top 0.406: R16.1 137.9,7.89 R18.2
  Top 1.93: T3.A2 138.35,7.44 R18.2 138.22,11.25 U$8.P$1
L$4
  Top 0.406: R19.1 138.8,51.95 R21.2
  Top 1.93: T4.A2 138.35,52.4 R21.2 138.48,48.59 U$11.P$1
L$5
  Top 0.406: R22.1 114.62,51.85 R24.2
  Top 1.016: U$14.P$1 114.3,47.57
  Top 1.778: 114.3,47.57 R24.2
  Top 1.93: T5.A2 114.17,52.3 R24.2
L$6
  Top 0.406: R25.1 90.38,52.6 R27.2
  Top 1.93: T6.A2 89.93,52.36 R27.2 90.06,48.55 U$17.P$1
N$2
  Top 0.406: R34.2 20.58,45.72 R2.2 16.75,45.78 D1.C
N$3
  Top 0.406: 57.2,9.68 57.18,9.66 | 57.2,9.68 OK2.15 | IC1.10 72.21,45.51 69.94,45.51 69.3,45.61 53.55,45.62 52.26,44.33 52.25,15.86 55.34,11.75 | 55.34,11.75 56.07,10.78 56.51,10.19 57.02,9.68 57.2,9.68 | R4.2 56.41,12.83 55.34,11.75
N$5
  Top 0.406: U1.1 87.33,21.39 R11.1
N$6  (via drill 0.6)
  Top 0.406: v69.98,44.26 72.23,44.26 IC1.11 | v66.56,5.28 67.79,5.26 R6.1 70.11,5.1 R5.2
  Bottom 0.406: v66.56,5.28 66.49,9.65 70.37,13.53 70.37,33.13 74.13,36.89 74.13,40.1 v69.98,44.26
N$7  (via drill 0.6)
  Top 0.406: R8.1 72.58,10.57 R7.1 68.25,10.53 | R8.1 70.75,10.62 | R8.1 70.26,10.62 v70.25,11.31 | v70.12,41.59 72.16,41.59 IC1.13
  Bottom 0.406: v70.25,11.31 70.18,11.59 71.3,12.72 71.3,32.68 75.03,36.41 75.03,40.85 70.45,45.44 69.11,45.44 68.91,45.24 68.91,42.85 70.12,41.64 v70.12,41.59
N$8
  Top 0.305: 76.45,29.35 U$1.P$5
  Top 0.406: 76.45,29.35 76.44,28.53 70.89,26.73 70.89,17.51 73.07,17.51 IC2.9
N$9
  Top 0.406: 72.71,8.72 R8.2 73.69,7.61 Q1.1
N$10
  Top 0.305: 77.05,27.98 77.05,30.71 U$1.P$6
  Top 0.406: IC2.7 71.84,26.19 77.05,27.98
N$11
  Top 0.305: 77.75,27.34 U$1.P$7
  Top 0.406: 77.75,27.34 74.33,26.19 IC2.5
N$12
  Top 0.305: U$1.P$10 77.75,38 75.34,39.42 75.34,45.22
  Top 0.406: IC1.5 75.79,45.5 75.34,45.22
N$13
  Top 0.305: 75.8,29.23 U$1.P$4
  Top 0.406: 75.8,29.23 70.01,27.32 69.98,15.62 75.61,15.62 IC2.11
N$14
  Top 0.305: U$1.P$11 77.07,37.45 74.62,38.98 74.63,46.99 75.64,48.04
  Top 0.406: 75.64,48.04 IC1.7
N$15
  Top 0.406: 84.79,5.01 84.79,8.82 82.25,11.36 U1.4 79.02,12.38 R1.2
  Top 1.93: T1.G 84.79,5.01
N$16
  Top 0.406: R10.2 U1.6
N$17  (via drill 0.6)  (1 unrouted)
  Top 0.305: U$27.P$8 v102.12,29.5
  Top 0.406: C33.1 12.58,26.45 12.67,26.36 15.27,26.36 v15.98,25.66
N$18
  Top 0.406: U2.1 128.92,25.29 R14.1
N$19
  Top 0.254: R16.2 U3.6
N$20
  Top 0.254: 116.74,7.56 R15.1
  Top 1.93: C5.1 119.15,9.84 R15.1
N$21
  Top 0.406: R13.2 126.05,14.77 U2.6
N$22
  Top 0.305: U$27.P$12 98.26,34.59
  Top 0.406: C31.1 104.26,45.48 102.1,43.74 102.1,37.41 105.43,37.37 U$23.P$2 105.52,36.45 U$22.P$10 105.5,34.28 98.57,34.28 98.26,34.59
N$23
  Top 0.254: 135.81,20.27 U3.1
  Top 0.406: 135.81,20.27 R17.1
N$24
  Top 0.406: R29.1 146.1,15.82 C6.2 149.05,11.38 C29.2
  Top 1.93: T3.A1 RS3.2 146.1,7.7 C6.2
N$25
  Top 0.254: R18.1 140.89,7.57
  Top 1.93: C6.1 143.3,9.85 R18.1
N$26
  Top 0.305: 21.09,8.28 U$26.9
  Top 0.406: 21.09,8.28 20.62,7.72 20.62,6.55 21.29,5.88 C19.1 21.94,3.91 C20.+
N$27
  Top 0.406: D1.A 4.1,48.15 9.73,53.78 30.17,53.78 C4.1 35.44,53.77 C2.2
N$28
  Top 0.406: R3.1 49.39,26.09 B1.~1
N$29
  Top 0.406: OK2.1 51.86,10.95 51.13,12.55 47.24,12.55 46.8,13.02 B1.+
N$30
  Top 0.406: OK2.2 54.45,9.68 54.45,9.95 54.41,11.32 50.67,16.27 B1.-
N$31
  Top 0.406: L1.2 46.18,39.76 60.24,53.82 62.92,53.82 C2.1
N$32
  Top 0.406: D2.A 23.56,45.76 D3.C 23.02,43.13 R34.1 20.58,43.17 R2.1
N$33
  Top 0.254: 140.89,39.57 U4.1
  Top 0.406: R20.1 140.89,39.57
N$34
  Top 0.254: R21.1 135.81,52.27
  Top 1.93: C7.1 133.4,49.99 R21.1
N$35
  Top 0.254: R12.1 92.41,7.55
  Top 1.93: C3.1 94.82,9.83 R12.1
N$36
  Top 0.406: U4.6 R19.2
N$37
  Top 0.406: OK3.1 41.38,9.58 R33.1
N$38
  Top 0.406: R23.1 130.85,42.07 118.77,42.07 118.77,40.09 U5.1
N$39
  Top 0.254: R24.1 111.63,52.17
  Top 1.93: C8.1 109.22,49.9 R24.1
N$40
  Top 0.406: R22.2 116.96,49.95 U5.6
N$41
  Top 0.406: R26.1 90.83,41.19 U6.1
N$42
  Top 0.406: T2.G 111.66,11.69 113.62,13.65 118.04,13.65 R28.2 118.99,17.12 U2.4
N$43
  Top 0.254: R27.1 87.39,52.23
  Top 1.93: C9.1 84.98,49.95 R27.1
N$44
  Top 0.406: U6.6 92.38,50.3 R25.2
N$45
  Top 0.305: 130.73,11.01 U3.4
  Top 0.406: 130.73,11.01 133.42,8.33 133.42,4.88 | U3.4 130.73,14.69 134.11,18.07 141.95,18.07 R29.2
  Top 1.93: T3.G 133.42,4.88
N$46
  Top 0.406: 143.43,54.81 143.43,51 145.97,48.46 U4.4 146.05,47.37 146.05,45.59 145.35,44.89 140.02,44.89 136.97,41.84 R30.2
  Top 1.93: 143.43,54.81 T4.G
N$47
  Top 0.406: R31.2 115.8,44.33 117.5,46.03 120.14,46.03 | 120.14,46.03 123.55,46.03 123.87,46.35 123.87,48.13 U5.4 | T5.G 116.71,54.82 118.54,52.99 118.54,51.65 119.97,50.22 119.97,46.2 120.14,46.03
N$48
  Top 0.406: U6.4 97.48,49.09 95.06,51.18 95.06,53.81 R32.2 95.06,54.73 95.07,54.73 95.07,57.32 T6.G
N$49  (via drill 0.6)
  Top 0.305: 98.94,41.49 98.94,35.28 U$27.P$11 98.91,36.5
  Top 0.406: C32.1 85.22,43.46 86,42.69 97.91,42.69 98.94,41.49 | 98.91,36.5 98.85,36.56 99.83,36.56 v99.88,36.51 | U$22.P$9 106.75,33.49 v106.75,35.03 U$23.P$3
  Bottom 0.406: v99.88,36.51 101.01,36.51 102.48,35.03 v106.75,35.03
N$50
  Top 0.406: R42.1 43.61,9.2 43.61,10.63 44.57,11.59 50.61,11.55 52,8.4 OK2.3
N$51  (via drill 0.6)
  Top 0.406: U5.2 121.31,38.04 v116.81,38.04 | v91.88,36.97 89.78,37.01 83.76,40.45 77.49,40.45 IC1.1
  Bottom 0.406: v116.81,38.04 116.74,43.75 116.14,44.29 94.41,44.33 93.67,43.6 93.68,37.2 93.39,36.96 v91.88,36.97
N$52
  Top 0.406: R43.1 46.06,9.22 46.06,10.27 46.36,10.57 49.94,10.57 52.12,5.87 OK2.5
N$53
  Top 0.406: OK2.7 52.09,3.3 49.59,8.99 48.65,9.07 R44.1
N$55
  Top 0.305: U$26.17 31.16,11.46
  Top 0.406: 31.16,11.46 32.9,14.41 33.49,14.41 | 33.49,14.41 35.22,14.41 OK3.7 | R45.1 34.81,19.28 33.42,17.89 33.42,14.48 33.49,14.41
N$57
  Top 0.406: 48.68,7.21 R44.2 SV1.7
N$58
  Top 0.406: D2.C 34.34,45.16 C11.+ 40.99,45.97 51.14,56.12 64.31,56.12 66.44,53.99 69.1,53.99 IC4.8
N$59
  Top 0.406: 46.18,7.25 R43.2 46.1,7.17 SV1.6
N$60
  Top 0.406: 43.68,7.27 R42.2 43.56,7.14 SV1.5
N$63
  Top 0.406: OK3.3 42.86,15.7 43.17,16.01 43.17,21.48 41.25,23.4 39.23,23.4 R49.1
N$64
  Top 0.406: C9.2 82.16,47.83 C32.2 85.11,44.88 86.49,43.5 88.22,43.5 88.45,43.59 89.92,44.82 92.73,44.82 93.73,45.83 93.73,53.49 92.96,54.52 R32.1
  Top 1.93: T6.A1 RS6.2 82.18,52.1 C9.2
N$66
  Top 0.406: SV1.3 38.48,6.97 R50.1 38.21,15.65 37.07,16.8 35.41,16.8 OK3.5
N$67
  Top 0.305: 25.97,10.21 U$26.15 26.68,10.19
  Top 0.406: 25.97,10.21 25.21,10.96 25.21,14.98 27.25,17.02 27.25,18.1 | 27.25,18.1 27.25,18.94 U$28.P$1 | C10.1 27.07,17.93 27.25,18.1
N$68
  Top 0.305: 26.53,11.12 26.5,10.83 26.67,10.83 U$26.16
  Top 0.406: 26.51,13.98 26.56,13.98 30.1,17.52 30.1,28.01 27.69,28.01 27.33,28.36 | 27.33,28.36 U$28.P$2 | C12.1 27.16,28.19 27.33,28.36
  Top 0.61: 26.53,11.12 26.51,13.98
N$69
  Top 0.305: 17.53,10.82 U$26.5
  Top 0.406: R37.1 8.18,11.54 C16.1 8.18,8.59 8.43,8.34 14.05,8.34 SV2.3 17.53,10.82
N$70
  Top 0.305: 18.92,10.19 U$26.6
  Top 0.406: R40.1 6.1,11.25 | R40.1 6.28,11.47 C18.1 6.23,13.8 R41.2 | 18.92,10.19 16.57,8.36 16.57,8.31 SV2.2 15.4,7.14 6.66,7.14 6.3,7.51 R40.1
N$71
  Top 0.305: U$26.19 29.71,12.73
  Top 0.406: 29.71,12.73 31.33,15.55 31.33,19.49 35.28,23.44 R49.2
N$72
  Top 0.305: 20.33,9.55 U$26.7
  Top 0.406: R39.1 2.22,9.47 C17.1 2.31,5.77 SV2.1 16.51,5.78 | 16.51,5.78 16.49,5.76 | 16.51,5.78 20.33,9.55
N$73
  Top 0.406: 41.18,7.25 R33.2 41.02,7.18 SV1.4
N$74
  Top 0.406: C8.2 106.42,52.05 RS5.2 | C8.2 106.42,48.32 108.44,46.29 111.08,46.29 R31.1 | C8.2 104.27,48.37 C31.2
  Top 1.93: RS5.2 T5.A1
N$75
  Top 0.406: R35.2 11.8,16 C13.1 11.86,17.9 13.6,17.9 R36.2
N$76  (via drill 0.6)
  Top 0.406: U$1.P$2 74.51,30.69 74.56,29.91 v72.36,29.46 | 61.24,7.14 v61.96,7.19 | OK2.13 61.24,7.14 | 61.24,7.14 62.01,7.14 R46.1
  Bottom 0.406: v72.36,29.46 72.24,29.12 72.24,10.82 68.44,6.76 68.44,5.01 67.11,3.94 64.96,3.94 61.96,6.93 v61.96,7.19
N$78
  Top 0.406: R37.2 8.23,15.68 C15.1 8.01,15.93 R38.1
N$79
  Top 0.406: IC4.1 74.55,54.23 75.99,54.23 77.26,55.5 V+J.1
N$80
  Top 0.406: 130.73,48.46 130.73,44.73 R30.1 | C30.2 130.49,48.35 C7.2
  Top 1.93: C7.2 130.73,48.46 RS4.2 T4.A1
N$83
  Top 0.305: U$27.P$7 99.56,30.2
  Top 0.406: 99.56,30.2 101.42,32.2 107.26,32.2 U$22.P$8 108.02,33.5 U$23.P$4 108.1,36.58 108.05,36.58 108.05,37.49 107.51,38.04 103.77,38.04 103.19,38.62 103.19,41.12 104.6,42.53 116.03,42.53 116.95,43.44 117.7,43.44 124.84,43.53 127.67,46.45 C30.1
N$84  (via drill 0.6)
  Top 0.305: U$27.P$6 98.91,28.63
  Top 0.406: 109.29,34.73 109.29,33.5 U$22.P$7 109.3,33.43 | 109.29,34.73 U$23.P$5 109.3,36.21 v110.55,36.15 | 98.91,28.63 99.37,28.17 v111.04,28.17 | v110.53,34.71 110.18,34.73 109.29,34.73 | C29.1 149.23,22.34 v135.17,36
  Bottom 0.406: v111.04,28.17 111.64,28.77 111.64,34.31 111.38,34.69 v110.53,34.71 | v135.17,36 110.79,36 v110.55,36.15
N$85
  Top 0.305: 98.28,29.49 U$27.P$5 98.27,29.5 98.27,28.21
  Top 0.406: C28.1 118.24,25.09 116.17,27.15 112.06,27.15 | 112.06,27.15 99.33,27.15 98.27,28.21 | U$23.P$7 108.07,39.24 108.07,38.87 109.08,37.85 111.45,37.85 112.03,37.27 112.03,30.66 111.19,30.66 U$22.P$5 112.06,30.55 112.06,27.15
N$86  (via drill 0.6)
  Top 0.406: C27.1 90.43,18.35 90.86,18.78 90.89,25.75 92.24,27.16 96.43,27.16 97.62,28.36 97.62,29.5 U$27.P$4 97.61,30.25 100.52,33.17 102.27,33.17 v102.35,33.25 | U$22.P$4 109.33,29.39 v109.34,29.28 109.26,29.3 v108.05,29.3 | v106.74,40.45 106.76,39.29 U$23.P$8
  Bottom 0.406: v109.34,29.28 109.32,40.45 v106.74,40.45 | v102.35,33.25 108.05,33.25 v108.05,29.3
N$87
  Top 0.406: RS2.2 121.95,7.56 C5.2 125.65,11.37 127.52,12.81 127.52,18.85 126.52,20.04 122.27,20.07 | R28.1 121.23,14.64 122.27,15.68 122.27,20.07 | 122.27,20.07 118.34,20.07 C28.2
  Top 1.93: T2.A1 RS2.2
N$88
  Top 0.406: 90.43,14.76 C27.2 | 90.43,14.76 92.13,13.07 97.36,13.07 97.7,12.73 97.7,11.44 C3.2 | 90.43,14.76 79.5,14.76 R1.1
  Top 1.93: T1.A1 RS1.2 97.49,11.23 C3.2
N$89
  Top 0.406: C33.2 10.59,23.56 SV3.4 10.76,21.74 12.93,21.75 13.62,21.03 R36.1 11.77,19.77 R64.1
NEUTRAL  (via drill 0.6)  (1 unrouted)
  Top 0.406: 71.94,56.68 71.73,56.47 71.73,51.78 | 71.94,56.68 69.39,56.68 IC4.6 IC4.7 69.32,56.19 69.33,56.2 67.4,56.2 65.11,58.5 50.05,58.5 40.78,49.22 32.69,49.22 30.74,47.27 30.74,45.57 D3.A 38.34,42.59 40.9,40.03 15.83,40.06 | IC4.2 IC4.3 72,56.75 71.94,56.68 | 2.05,13.62 R39.2 2.22,21.43 SV3.1 | SV3.3 7.99,19.85 R38.2 | v2.84,29.44 2.9,29.5 v7.99,29.5 8.06,29.43 9.95,29.43 10.94,30.43 10.94,35.39 13.12,37.57 GNDJ.3 15.83,40.06 | 71.73,51.78 71.73,51.75 | 71.73,51.78 v74.71,51.78 | v99.84,55.13 97.66,57.31 U$18.P$1 | C4.2 2.78,40.12 15.83,40.06 | B1.~2 40.99,28.24 C11.-
  Top 1.93: RS1.1 U$3.P$1 U$4.P$1 | RS2.1 U$6.P$1 U$7.P$1 | RS3.1 U$9.P$1 U$10.P$1 | RS4.1 U$12.P$1 U$13.P$1 | RS5.1 U$15.P$1 U$16.P$1 | RS6.1 U$18.P$1 U$19.P$1
  Bottom 0.406: v2.84,29.44 2.84,23.68 SV3.1 | SV3.3 8.06,29.43 v7.99,29.5 | v99.84,55.13 77.92,55.04 74.71,51.83 v74.71,51.78
  Bottom 1.93: 106.52,2.48 106.47,2.48 106.47,2.46 97.39,2.48 92.26,7.61 82.69,7.63 82.45,7.63 82.45,7.61 82.25,7.61 RS1.1 82.22,7.55 82.22,2.54 78.32,2.54 78.32,2.37 | 106.52,2.48 106.52,7.63 | 130.71,7.55 130.71,2.49 U$9.P$1 130.84,2.49 130.84,2.54 121.04,2.49 115.91,7.61 106.57,7.68 106.57,7.61 106.63,7.61 RS2.1 | U$12.P$1 149.87,57.35 150.03,57.19 150.03,30.38 | RS3.1 130.78,7.61 139.79,7.61 150.03,17.85 150.03,30.38 | U$16.P$1 131.06,57.26 136.08,52.23 146.01,52.23 146.01,57.38 RS4.1 | 97.41,57.34 97.61,57.34 97.42,57.31 U$19.P$1 | 125.67,57.18 125.67,57.34 121.77,57.34 121.77,52.17 RS5.1 121.79,52.23 112.07,52.23 106.99,57.31 97.27,57.37 97.48,57.17 97.48,52.23 RS6.1 | U$6.P$1 106.52,2.48 | 150.03,30.38 U$20.P$1
O$2
  Top 0.305: 20.3,11.46 U$26.4
  Top 0.406: C14.1 11.76,11.91 R35.1 15.89,14.05 SV2.4 18.37,13.39 20.3,11.46
SAW  (via drill 0.6)
  Top 0.406: 73.07,22.39 IC2.6 | 73.07,22.39 75.64,22.39 75.64,24.62 IC2.4 | 72.99,21.32 71.86,21.32 71.86,19.42 IC2.8 | 72.99,21.32 74.34,21.32 IC2.10 74.34,16.99 v74.26,16.91 | 73.07,22.39 72.99,22.31 72.99,21.32 | 74.91,9.56 74.91,10.67 C1.1 74.8,11.28 73.81,12.27 66.69,12.27 66.06,11.64 R9.1 | IC1.6 79.18,46.77 79.61,46.34 79.61,44.33 79.51,44.23 IC1.4 79.83,44.31 v79.74,44.34 | v74.07,9.63 74.84,9.63 74.91,9.56 | 74.91,9.56 75.68,9.56 v75.72,9.52 75.89,9.35 Q1.3
  Bottom 0.406: v79.74,44.34 80.36,44.34 81.1,43.6 81.1,28.46 75.72,23.08 v75.72,9.52 | v74.07,9.63 74.07,16.72 v74.26,16.91
SCL  (via drill 0.6)
  Top 0.305: 95.66,31.88 U$27.P$1 | U$26.18 30.39,12.09
  Top 0.406: 94.97,32.54 93.95,33.52 75.16,33.49 73.87,34.75 73.87,36.43 U$1.P$16 | 94.97,32.54 95.66,31.88 | 30.39,12.09 32.15,15.11 32.15,15.66 | v81.16,26.7 89.19,26.7 94.97,32.54 | 32.15,15.66 v32.45,15.68 | 32.15,15.66 32.15,19.04 34.42,21.3 37.21,21.3 R48.1 | OK2.9 62.97,2.06 v63.79,2.88 65.21,2.88 v65.23,2.87
  Bottom 0.406: v32.45,15.68 35.38,15.68 43.65,7.8 58.87,7.8 v63.79,2.88 | v65.23,2.87 70.66,2.87 76.87,9.03 76.87,22.42 v81.16,26.7
SDA  (via drill 0.6)
  Top 0.305: 96.99,31.59 96.99,29.54 U$27.P$3 | U$26.20 29.25,13.36
  Top 0.406: OK2.11 61.81,4.58 62.5,5.37 v63.76,7.18 63.85,7.18 v63.88,8.98 63.86,10.79 R47.1 | 96.99,31.59 94.36,34.28 75.54,34.33 74.5,35.33 U$1.P$15 74.45,37.02 74.18,37.3 73.88,37.61 v72.75,37.61 | 29.25,13.36 v29.25,14.35
  Bottom 0.406: v72.75,37.61 71.11,37.61 69.46,35.96 69.41,14.21 64.92,9.72 64.92,8.16 63.91,7.15 63.96,7.18 v63.76,7.18 | v29.25,14.35 32.09,17.19 35.85,17.26 44.24,8.73 v63.88,8.98
V+  (via drill 0.6)  (1 unrouted)
  Top 0.305: 78.41,26.94 78.42,29.29 78.42,30.68 U$1.P$8 | U$1.P$9 78.42,38.42 75.91,39.85 75.92,42.43 | 96.3,28.66 U$27.P$2 | U$27.P$13 97.66,35.3 v97.66,36.78 | U$26.2
  Top 0.406: 57.7,5.87 57.69,5.87 57.69,3.33 OK2.10 62.27,3.33 66.12,7.18 66.12,8.43 R9.2 | 57.7,5.87 OK2.12 | 78.41,26.94 76.88,25.75 IC2.3 76.88,22.91 87.14,22.91 87.8,23.54 87.8,24.5 88.46,25.15 R11.2 88.98,25.15 91.81,27.98 94.2,27.98 | 68.3,7.35 R6.2 | 68.3,8.67 R7.2 | 58.05,10.95 OK2.16 60.23,10.95 | R14.2 133.93,24.1 R17.2 133.72,24.08 133.72,31.9 133.71,37.31 | 133.71,37.31 R20.2 133.71,39.25 R23.2 | 75.92,42.43 76.45,42.89 77.39,42.89 IC1.3 77.48,42.93 80.89,42.94 | 67.96,8.48 68.3,8.67 | R9.2 67.96,8.48 | R26.2 85.94,41.19 84.35,42.13 81.69,42.14 80.89,42.94 | U$26.2 U$26.1 21.65,13.04 20.32,13.04 16.57,17.81 C22.+ 16.73,19.69 C21.1 | 67.96,8.48 68.09,8.49 | 59.28,8.45 OK2.14 | 59.28,8.45 57.7,8.45 57.7,5.87 | 59.28,8.45 60.27,8.41 60.43,8.65 60.43,10.75 60.23,10.95 | U$1.P$3 75.16,30.72 75.16,31.82 | U$1.P$8 78.38,30.73 78.38,31.88 78.32,31.82 75.16,31.82 | 75.16,31.82 75.14,31.8 72.79,31.8 72.29,32.3 C26.+ 72.29,35.68 C25.1 | 68.3,8.67 68.3,7.35 | 68.3,7.35 68.39,7.26 68.46,7.2 v70.98,7.18 | v79.78,29.29 78.42,29.29 | 80.89,42.94 80.85,42.98 80.85,46.82 80.1,47.57 v80.1,48.46 80.1,55.08 V+J.3 | R9.2 66.06,8.32 | U$27.P$2 | 96.3,28.66 95.62,27.98 94.2,27.98 | v94.27,29.21 94.2,29.14 94.2,27.98 | C34.1 96.31,36.78 v97.66,36.78 | v142.23,37.3 141.95,37.31 133.71,37.31 | U$26.2 21.99,13.09 22.01,13.06 24.06,13.06 24.3,12.84 24.3,10.19 28.17,6.37 30.1,6.37 35.24,11.71 | 35.24,11.71 OK3.8 | 35.24,11.71 33.78,11.71 v33.71,11.64 | v60.14,12.02 60.23,11.93 60.23,10.95
  Bottom 0.305: 97.65,32.68 97.61,36.74
  Bottom 0.406: 97.61,36.74 v97.66,36.78 | 97.65,32.68 94.3,29.6 v94.27,29.21 | v142.23,37.3 142.22,43.29 135.35,50.16 94.99,50.08 83.83,50.08 82.21,48.46 v80.1,48.46 | v70.98,7.18 73.13,9.33 73.13,22.02 79.78,28.68 v79.78,29.29 | v33.71,11.64 29.81,11.57 27.96,13.41 27.96,15.03 31.3,18.36 36.39,18.43 44.03,10.8 59.73,10.8 60.14,11.21 v60.14,12.02

### Text on the board
tNames: GND | Neutal | AGND | DGND | Hot | Neutral
tValues: MUX | D > A | 5V_EXTERNAL | GND_EXTERNAL | DOUT METER | CS METER | SYNC D>A | SDA | SCL